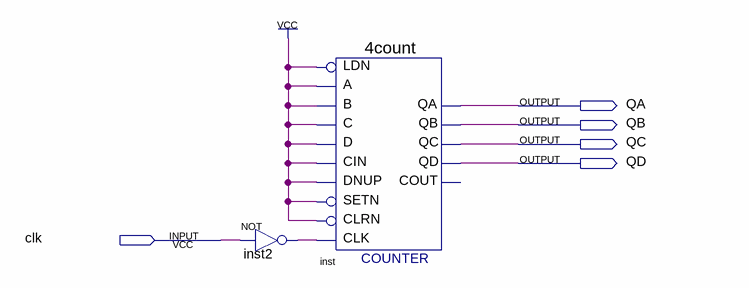
[diagram p0: schematic sheet]
// Quartus schematic Test2.bdf as structural Verilog: 2 symbols, 5 pins
module Test2 (
  input  clk,
  output QA,
  output QB,
  output QC,
  output QD
);

  wire inst2_out;

  not inst2 (inst2_out, clk);
  \4count  inst (
    .LDN(1'b1), .B(1'b1), .A(1'b1), .D(1'b1), .CIN(1'b1), .DNUP(1'b1), .CLK(inst2_out), .SETN(1'b1),
    .C(1'b1), .CLRN(1'b1), .QA(QA), .QB(QB), .QC(QC), .QD(QD));  // open: COUT
endmodule
